# EAGLE schematic Untitled_b2 (EAGLE 6.5.0)
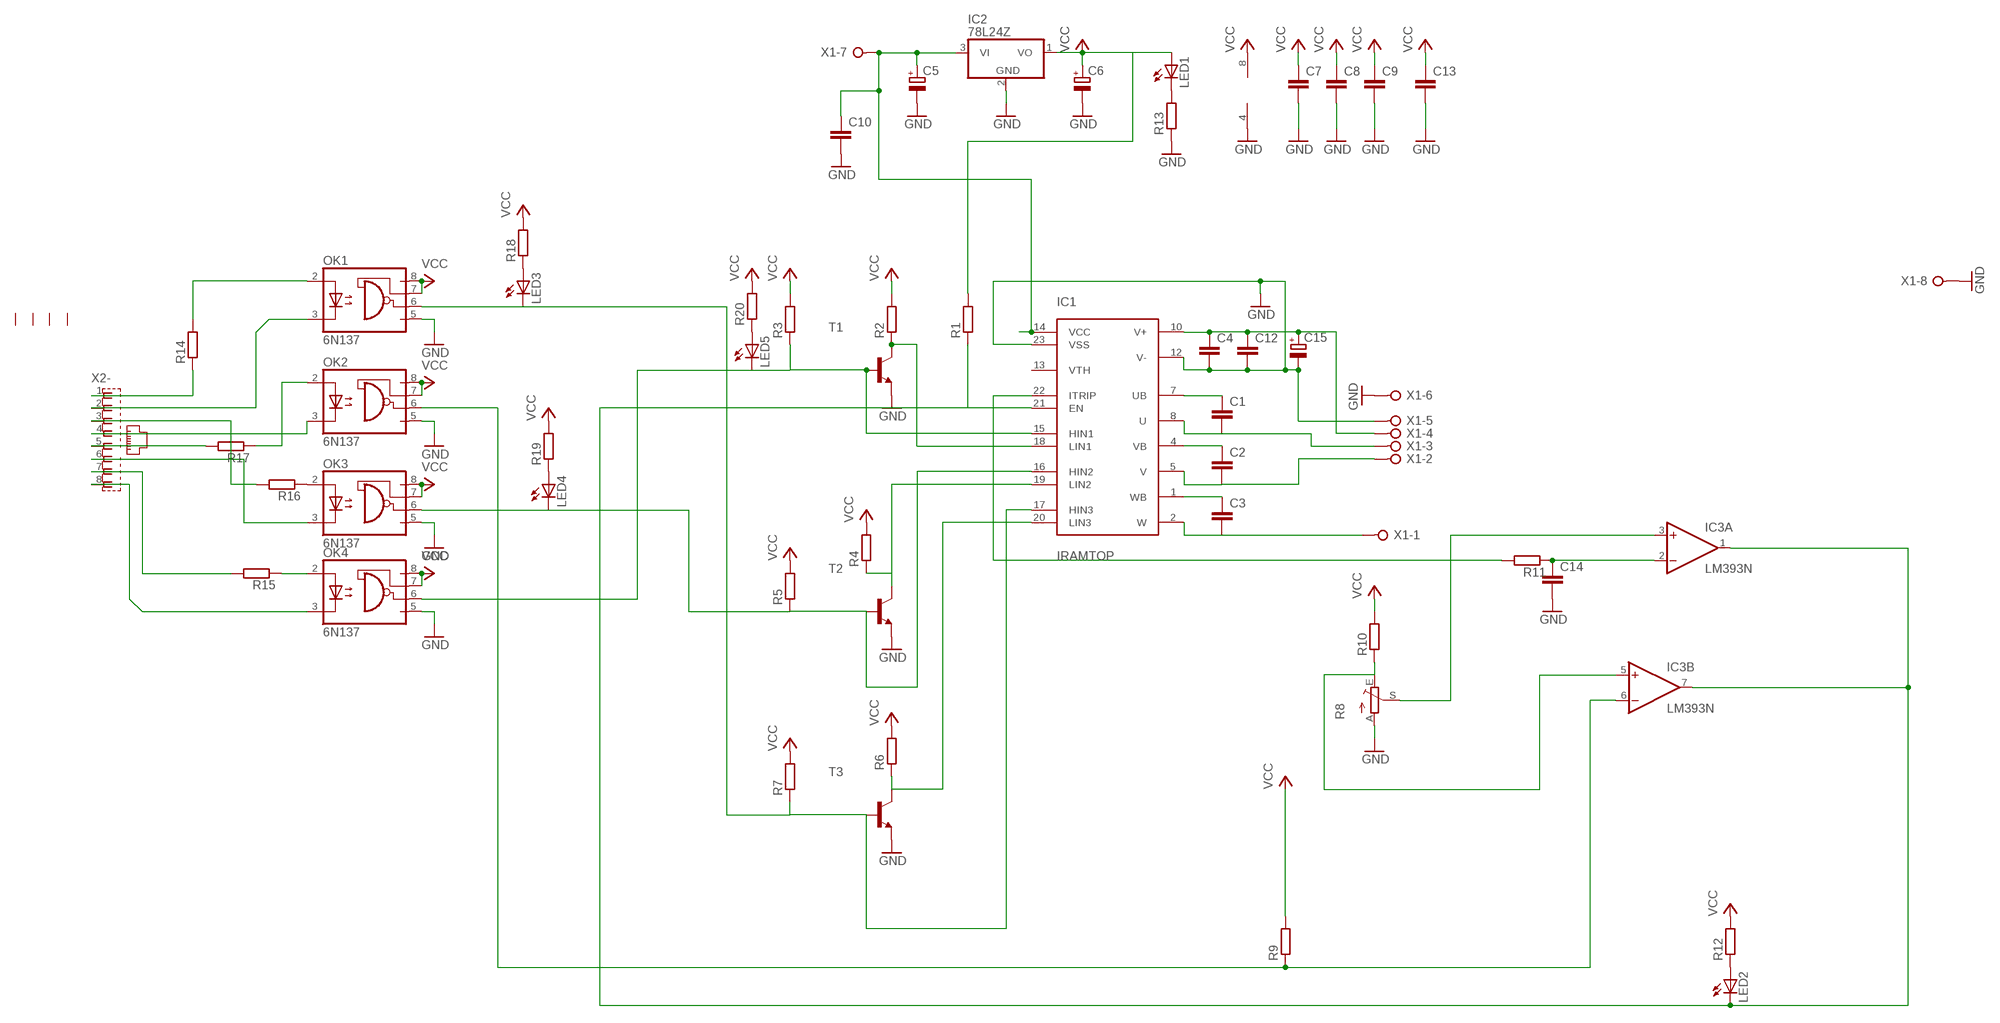
[diagram p0: schematic, sheet 1]

## Parts
C1  C5/5  [C5B5]
C2  C5/5  [C5B5]
C3  C5/5  [C5B5]
C4  C5/5  [C5B5]
C5  CPOL-EUE2.5-5  [E2,5-5]
C6  CPOL-EUE2.5-5  [E2,5-5]
C7  C-EU050-025X075  [C050-025X075]
C8  C-EU050-025X075  [C050-025X075]
C9  C-EU050-025X075  [C050-025X075]
C10  C-EU050-025X075  [C050-025X075]
C12  C-EU150-054X183  [C150-054X183]
C13  C-EU050-025X075  [C050-025X075]
C14  C-EU050-025X075  [C050-025X075]
C15  CPOL-EUE10-25  [EB25D]
IC1  IRAMTOP  [SIP23_TOP]
IC2  78L24Z  [TO92]
IC3  LM393N  [DIL08]
LED1  LED5MM  [LED5MM]
LED2  LED5MM  [LED5MM]
LED3  LED5MM  [LED5MM]
LED4  LED5MM  [LED5MM]
LED5  LED5MM  [LED5MM]
OK1  6N137  [DIL08]
OK2  6N137  [DIL08]
OK3  6N137  [DIL08]
OK4  6N137  [DIL08]
R1  R-EU_0204/7  [0204/7]
R2  R-EU_0204/7  [0204/7]
R3  R-EU_0204/7  [0204/7]
R4  R-EU_0204/7  [0204/7]
R5  R-EU_0204/7  [0204/7]
R6  R-EU_0204/7  [0204/7]
R7  R-EU_0204/7  [0204/7]
R8  TRIM_EU-CA6V  [CA6V]
R9  R-EU_0204/7  [0204/7]
R10  R-EU_0204/7  [0204/7]
R11  R-EU_0204/7  [0204/7]
R12  R-EU_0204/7  [0204/7]
R13  R-EU_0204/7  [0204/7]
R14  R-EU_0204/2V  [0204V]
R15  R-EU_0204/2V  [0204V]
R16  R-EU_0204/2V  [0204V]
R17  R-EU_0204/2V  [0204V]
R18  R-EU_0204/7  [0204/7]
R19  R-EU_0204/7  [0204/7]
R20  R-EU_0204/7  [0204/7]
T1  BC547-NPN-TO92-CBE  [TO92-CBE]
T2  BC547-NPN-TO92-CBE  [TO92-CBE]
T3  BC547-NPN-TO92-CBE  [TO92-CBE]
X1  W237-08P  [W237-8P]
X2  RJ45  [RJ45]

## Nets
GND: C4.2 C5.- C6.- C7.2 C8.2 C9.2 C10.2 C12.2 C13.2 C14.2 C15.- IC1.12(V-) IC1.23(VSS) IC2.2(GND) IC3.4(P:V-) OK1.5(GND) OK2.5(GND) OK3.5(GND) OK4.5(GND) R8.A R13.1 T1.E T2.E T3.E X1.5 X1.6 X1.8
N$1: C1.1 IC1.7(UB)
N$2: C1.2 IC1.8(U) X1.3
N$3: C2.1 IC1.4(VB)
N$4: C2.2 IC1.5(V) X1.2
N$5: C3.1 IC1.1(WB)
N$6: C3.2 IC1.2(W) X1.1
N$7: LED2.A R12.1
N$8: C14.1 IC3.2(A:-IN) R11.1
N$9: C5.+ C10.1 IC1.14(VCC) IC2.3(VI) X1.7
N$10: IC1.21(EN) IC3.1(A:OUT) IC3.7(B:OUT) LED2.K(C) R1.1
N$11: IC1.15(HIN1) OK4.6(VO) R3.1 T1.B
N$12: IC1.18(LIN1) R2.1 T1.C
N$13: IC1.19(LIN2) R4.1 T2.C
N$14: IC1.16(HIN2) OK3.6(VO) R5.1 T2.B
N$15: IC1.20(LIN3) R6.1 T3.C
N$16: OK3.3(C) X2.6
N$17: R16.2 X2.3
N$18: OK4.3(C) X2.8
N$19: OK2.3(C) X2.4
N$20: OK1.3(C) X2.2
N$21: OK1.2(A) R14.2
N$22: R17.2 X2.5
N$23: R15.2 X2.7
N$24: IC1.17(HIN3) OK1.6(VO) R7.1 T3.B
N$25: IC3.3(A:+IN) R8.S
N$26: IC1.22(ITRIP) R11.2
N$27: IC3.5(B:+IN) R8.E R10.1
N$28: LED1.K(C) R13.2
N$29: IC3.6(B:-IN) OK2.6(VO) R9.1
N$30: C4.1 C12.1 C15.+ IC1.10(V+) X1.4
N$31: R14.1 X2.1
N$32: OK4.2(A) R15.1
N$33: OK3.2(A) R16.1
N$34: OK2.2(A) R17.1
N$36: LED3.A R18.1
N$37: LED4.A R19.1
N$38: LED5.A R20.1
VCC: C6.+ C7.1 C8.1 C9.1 C13.1 IC2.1(VO) IC3.8(P:V+) LED1.A OK1.7(VE) OK1.8(VCC) OK2.7(VE) OK2.8(VCC) OK3.7(VE) OK3.8(VCC) OK4.7(VE) OK4.8(VCC) R1.2 R2.2 R3.2 R4.2 R5.2 R6.2 R7.2 R9.2 R10.2 R12.2 R18.2 R19.2 R20.2
Unconnected: IC1.13(VTH) LED3.K(C) LED4.K(C) LED5.K(C) X2.G1 X2.G2 X2.G3 X2.G4

## Library data of the parts
C1-C4 = capacitor-wima:C: CAPACITOR naming: grid - package width
C5 C6 C15 = rcl:CPOL-EU: POLARIZED CAPACITOR, European symbol
C7-C10 C12-C14 = rcl:C-EU: CAPACITOR, European symbol
IC1 = iram-b:IRAM
IC2 = linear:78*: Positive VOLTAGE REGULATOR Source: http://cache.national.com/ds/LM/LM78L05.pdf http://www.fairchildsemi.com/ds/LM/LM7805.pdf
IC3 = linear:LM393: COMPARATOR
LED1-LED5 = led:LED: LED OSRAM: - CHIPLED LG R971, LG N971, LY N971, LG Q971, LY Q971, LO R971, LY R971 LH N974, LH R974 LS Q976, LO Q976, LY Q976 LO Q996 - Hyper CHIPLED LW Q18S LB Q993, LB Q99A, LB R99A - SideLED LS A670, LO A670, LY A670, LG A670, LP A670 LB A673, LV A673, LT A673, LW A673 LH A674 LY A675 LS A676, LA A676, LO A676, LY A676, LW A676 LS A679, LY A679, LG A679 - Hyper Micro SIDELED® LS Y876, LA Y876, LO Y876, LY Y876 LT Y87S - SmartLED LW L88C, LW L88S LB L89C, LB L89S, LG L890 LS L89K, LO L89K, LY L89K LS L896, LA L896, LO L896, LY L896 - TOPLED LS T670, LO T670, LY T670, LG T670, LP T670 LSG T670, LSP T670, LSY T670, LOP T670, LYG T670 LG T671, LOG T671, LSG T671 LB T673, LV T673, LT T673, LW T673 LH T674 LS T676, LA T676, LO T676, LY T676, LB T676, LH T676, LSB T676, LW T676 LB T67C, LV T67C, LT T67C, LS T67K, LO T67K, LY T67K, LW E67C LS E67B, LA E67B, LO E67B, LY E67B, LB E67C, LV E67C, LT E67C LW T67C LS T679, LY T679, LG T679 LS T770, LO T770, LY T770, LG T770, LP T770 LB T773, LV T773, LT T773, LW T773 LH T774 LS E675, LA E675, LY E675, LS T675 LS T776, LA T776, LO T776, LY T776, LB T776 LHGB T686 LT T68C, LB T68C - Hyper Mini TOPLED® LB M676 - Mini TOPLED Santana® LG M470 LS M47K, LO M47K, LY M47K Source: http://www.osram.convergy.de LUXEON: - LUMILED® LXK2-PW12-R00, LXK2-PW12-S00, LXK2-PW14-U00, LXK2-PW14-V00 LXK2-PM12-R00, LXK2-PM12-S00, LXK2-PM14-U00 LXK2-PE12-Q00, LXK2-PE12-R00, LXK2-PE12-S00, LXK2-PE14-T00, LXK2-PE14-U00 LXK2-PB12-K00, LXK2-PB12-L00, LXK2-PB12-M00, LXK2-PB14-N00, LXK2-PB14-P00, LXK2-PB14-Q00 LXK2-PR12-L00, LXK2-PR12-M00, LXK2-PR14-Q00, LXK2-PR14-R00 LXK2-PD12-Q00, LXK2-PD12-R00, LXK2-PD12-S00 LXK2-PH12-R00, LXK2-PH12-S00 LXK2-PL12-P00, LXK2-PL12-Q00, LXK2-PL12-R00 Source: www.luxeon.com KINGBRIGHT: KA-3528ASYC Source: www.kingbright.com
OK1-OK4 = optocoupler:6N137: MOTOROLA OPTO COUPLER; MPN: 6N137; OC_FARNELL: 1328376; OC_NEWARK: 52M1895
R1-R7 R9-R20 = rcl:R-EU_: RESISTOR, European symbol
R8 = pot:TRIM_EU-: POTENTIOMETER
T1-T3 = transistor:*-NPN-: NPN Transistror BF959 corrected 2008.03.06
X1 = con-wago-508:W237-08P: WAGO SREW CLAMP; OC_FARNELL: unknown; OC_NEWARK: unknown
X2 = con-appsys:RJ45: AMP connector